# Altium schematic sheet Yazaki Led.SchDoc
size A4; SheetNumber: 1; SheetTotal: 5
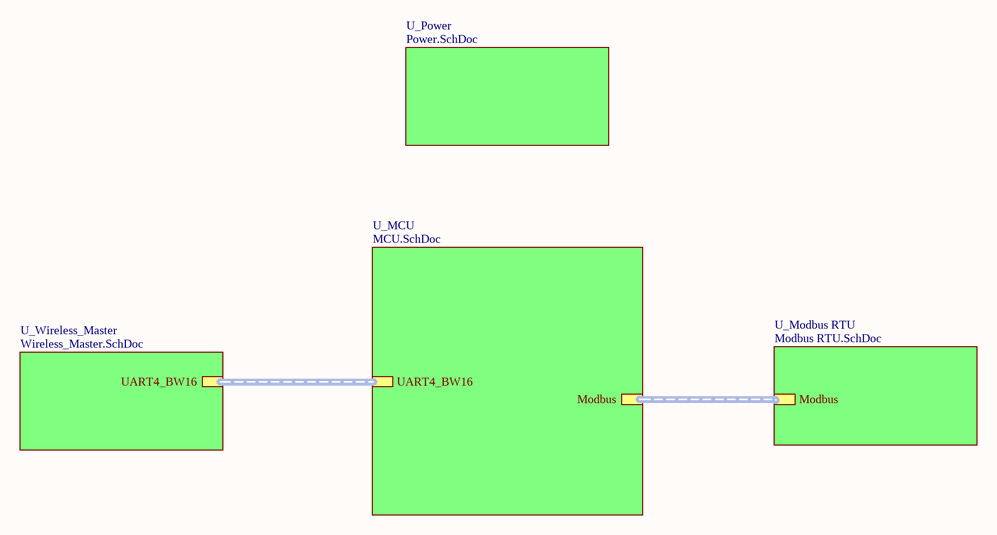
[diagram p0: Yazaki Led.SchDoc]

## Sub-sheets
U_MCU = MCU.SchDoc: Modbus (harness Modbus), UART4_BW16 (harness UART4_ESP32)
U_Modbus RTU = Modbus RTU.SchDoc: Modbus (harness Modbus)
U_Power = Power.SchDoc: no entries
U_Wireless_Master = Wireless_Master.SchDoc: UART4_BW16 (harness UART4_ESP32)

## Buses and harness runs
harness sheet U_MCU/Modbus = sheet U_Modbus RTU/Modbus
harness sheet U_MCU/UART4_BW16 = sheet U_Wireless_Master/UART4_BW16

## Notes on the sheet
- Title
- Size:
- Date:
- A3
- Number:
- Time:
- Revision:
- Sheet
- of
- NICHIETSUVN.COM <http://NICHIETSUVN.COM>
- R&D
- File: